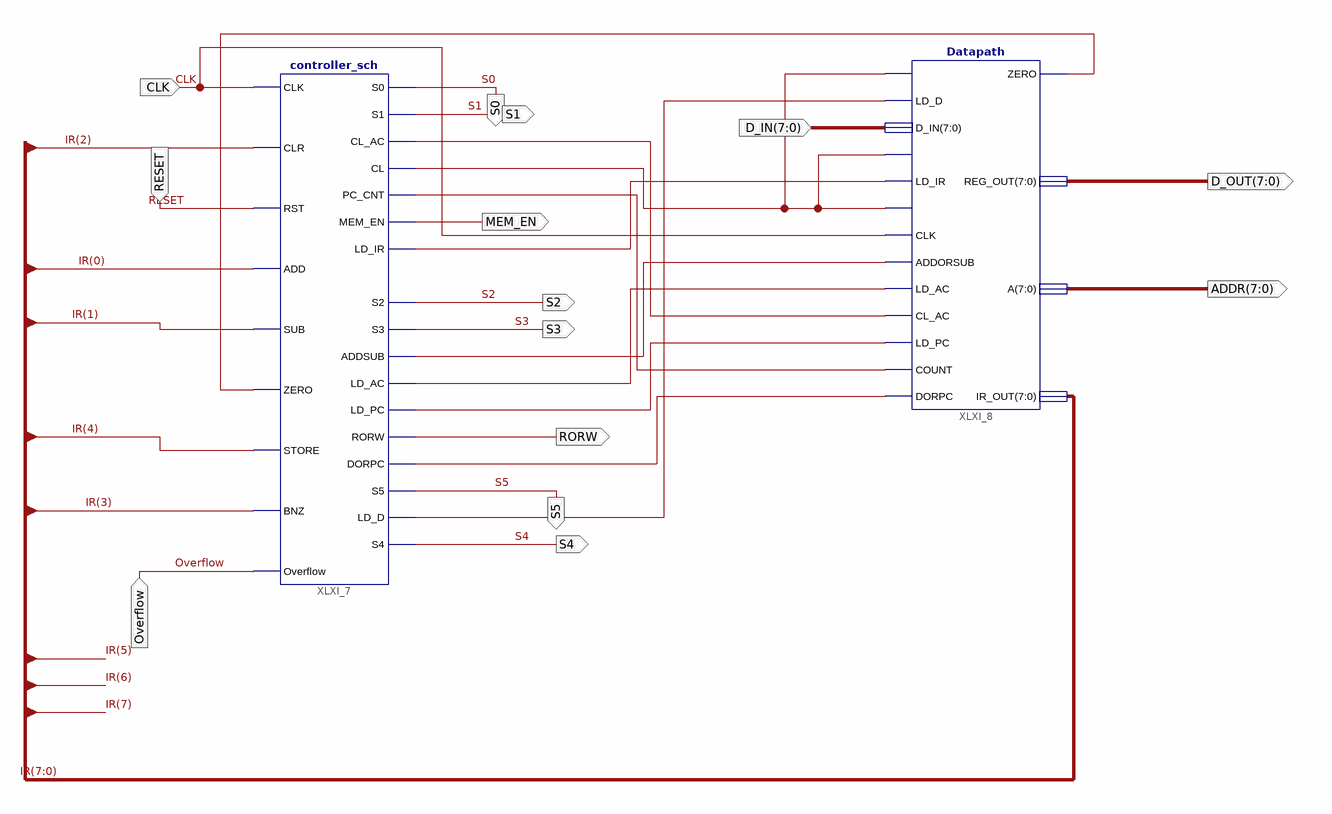
[diagram p0: schematic sheet 1]
// Xilinx ISE schematic toy_sch.sch (spartan3e) as structural Verilog: 2 symbols, 14 ports
module toy_sch (
  input  CLK,
  input  RESET,
  input  [7:0] D_IN,
  input  Overflow,
  output MEM_EN,
  output S2,
  output S3,
  output RORW,
  output S4,
  output S5,
  output S0,
  output S1,
  output [7:0] D_OUT,
  output [7:0] ADDR
);

  wire XLXN_56, XLXN_59, XLXN_60, XLXN_62, XLXN_65, XLXN_66, XLXN_67, XLXN_69, XLXN_70, XLXN_75;
  wire [7:0] IR;

  controller_sch XLXI_7 (
    .CLK(CLK), .CLR(IR[2]), .RST(RESET), .ADD(IR[0]), .SUB(IR[1]), .ZERO(XLXN_75), .STORE(IR[4]),
    .BNZ(IR[3]), .Overflow(Overflow), .S1(S1), .CL_AC(XLXN_56), .CL(XLXN_59), .PC_CNT(XLXN_60),
    .MEM_EN(MEM_EN), .LD_IR(XLXN_62), .S2(S2), .S3(S3), .ADDSUB(XLXN_65), .LD_AC(XLXN_66), .LD_PC(XLXN_67),
    .DORPC(XLXN_69), .S5(S5), .LD_D(XLXN_70), .S4(S4), .S0(S0), .RORW(RORW));
  Datapath XLXI_8 (
    .DORPC(XLXN_69), .CL_D(XLXN_59), .LD_D(XLXN_70), .D_IN(D_IN), .CL_PC(XLXN_59), .CLK(CLK),
    .LD_PC(XLXN_67), .COUNT(XLXN_60), .LD_AC(XLXN_66), .CL_AC(XLXN_56), .ADDORSUB(XLXN_65), .CL_IR(XLXN_59),
    .LD_IR(XLXN_62), .IR_OUT(IR), .A(ADDR), .ZERO(XLXN_75), .REG_OUT(D_OUT));
endmodule
